# Altium schematic sheet Driveunit_RS485_Topsheet.SchDoc
size A3; SheetNumber: 1; SheetTotal: 1
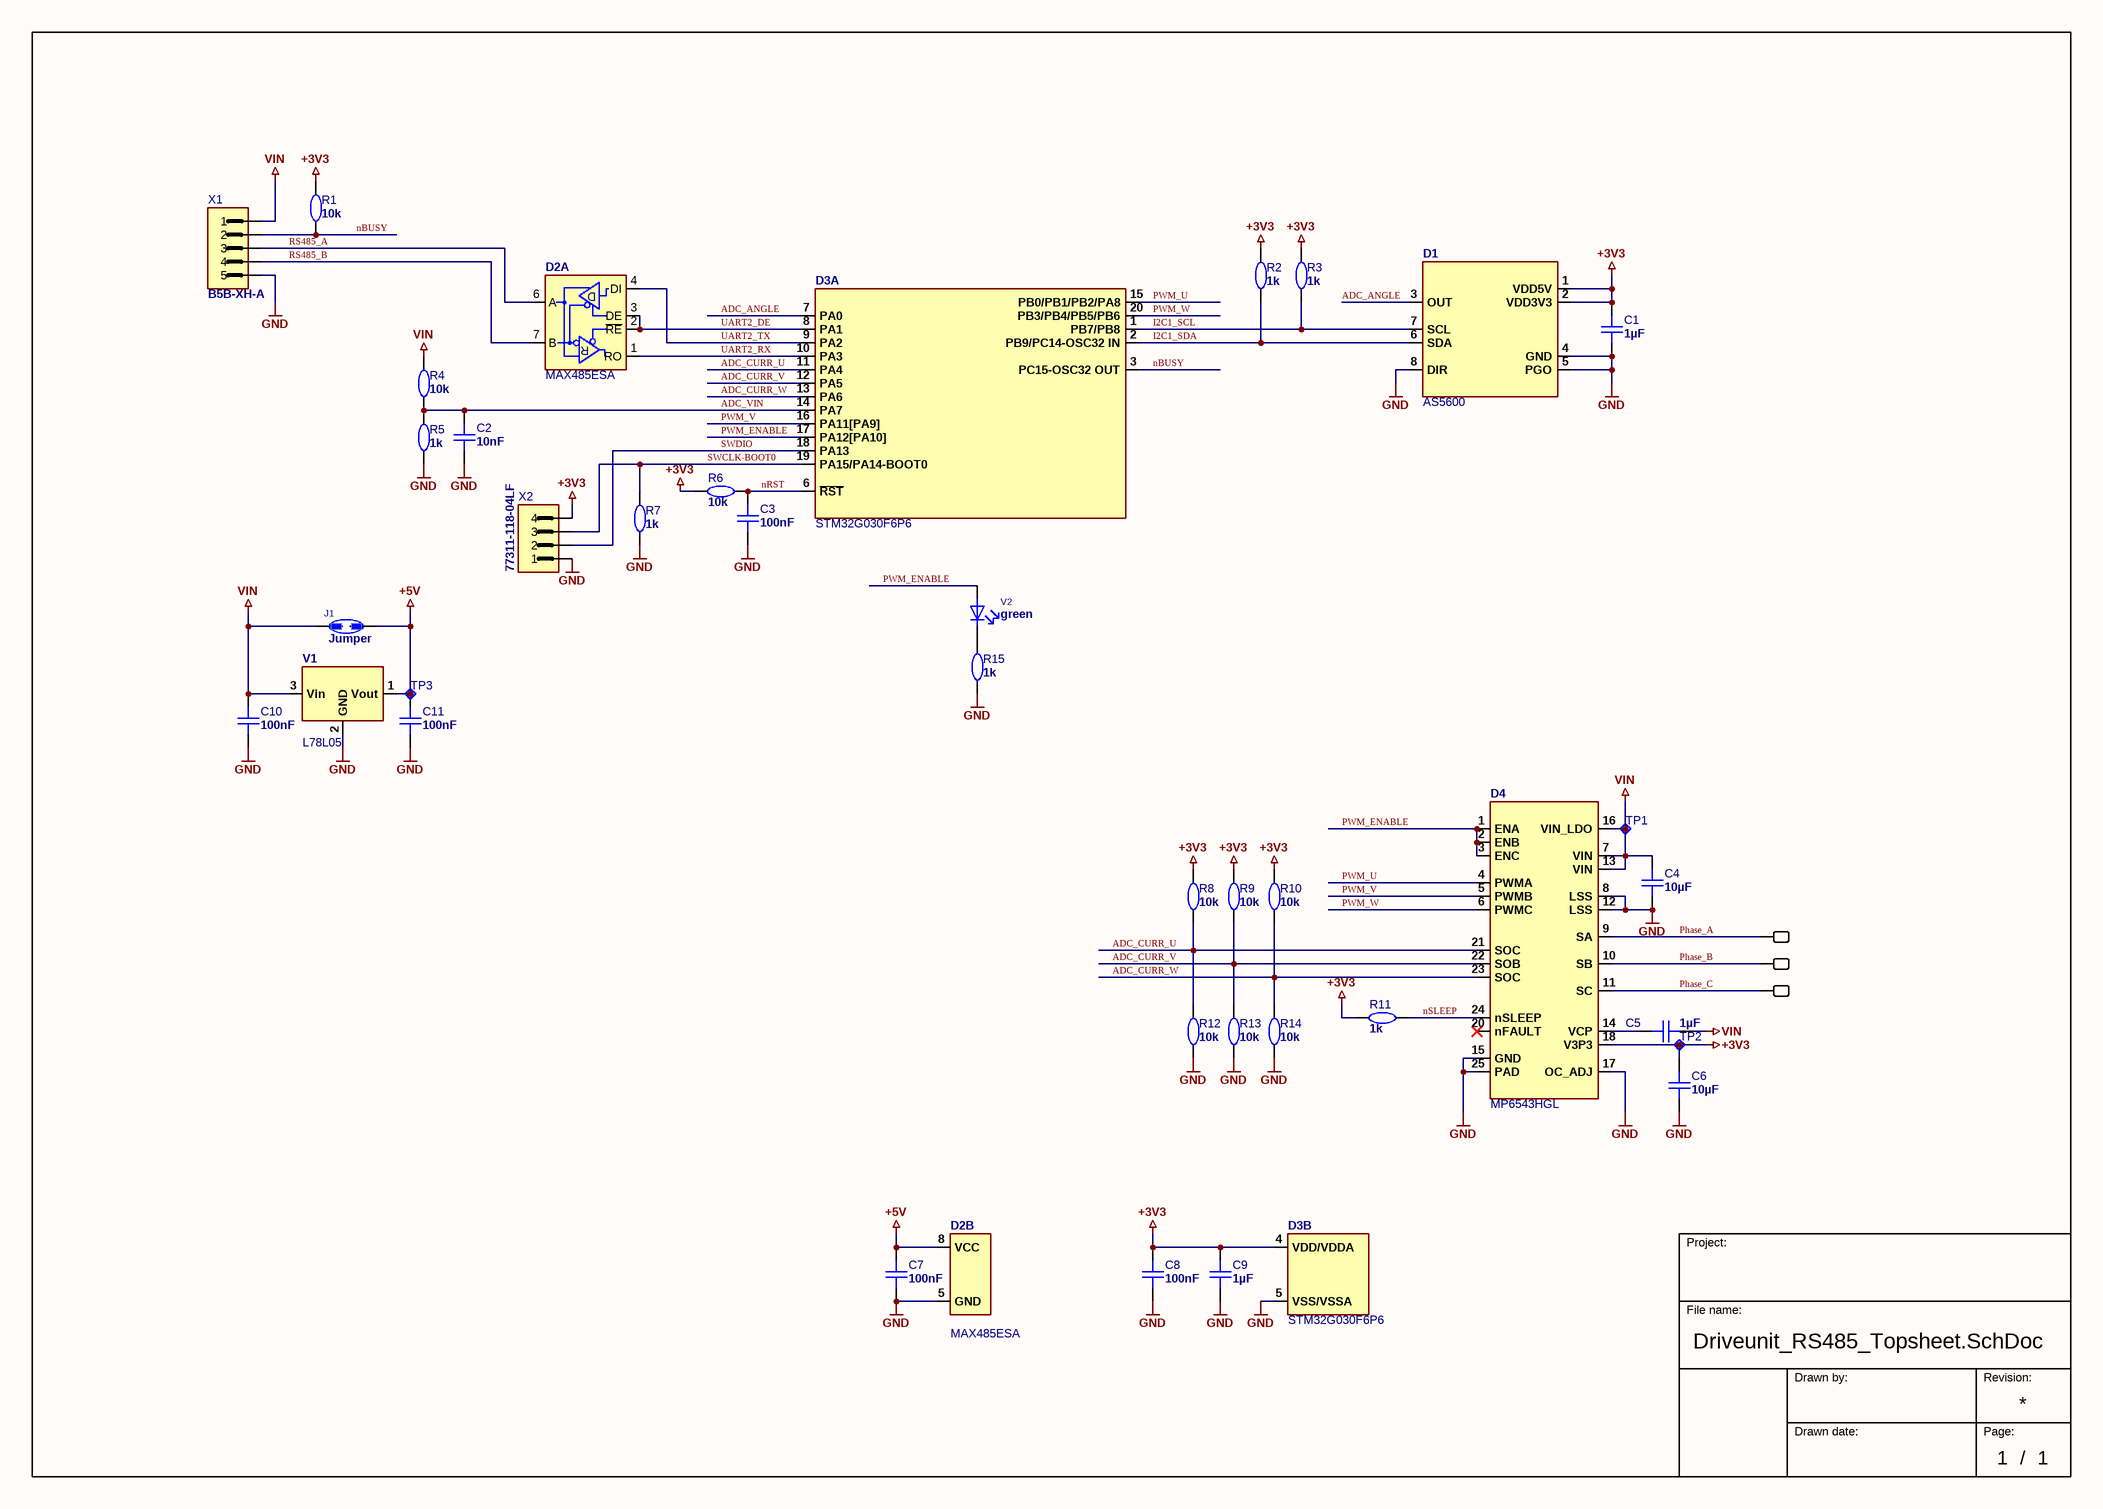
[diagram p0: Driveunit_RS485_Topsheet.SchDoc]

## Parts
C1  value 1µF  [C-0603_1608_095_L_RF]  (hidden comment: Cap 1u 0603)
C2  value 10nF  [C-0603_1608_095_L_RF]  (hidden comment: Cap 10n 0603)
C3  value 100nF  [C-0603_1608_095_L_RF]  (hidden comment: Cap 100n 0603)
C4  value 10µF  [C-1210_3225_230_L_RF]  (hidden comment: CAP 10u 1210)
C5  value 1µF  [C-0603_1608_095_L_RF]  (hidden comment: Cap 1u 0603)
C6  value 10µF  [C-0805_2012_145_L_RF]  (hidden comment: CAP 10u 16V 0805)
C7  value 100nF  [C-0603_1608_095_L_RF]  (hidden comment: Cap 100n 0603)
C8  value 100nF  [C-0603_1608_095_L_RF]  (hidden comment: Cap 100n 0603)
C9  value 1µF  [C-0603_1608_095_L_RF]  (hidden comment: Cap 1u 0603)
C10  value 100nF  [C-0603_1608_095_L_RF]  (hidden comment: Cap 100n 0603)
C11  value 100nF  [C-0603_1608_095_L_RF]  (hidden comment: Cap 100n 0603)
D1  AS5600  [SOIC8_N_RF]
D2  MAX485ESA  [SOIC8_N_RF]  (parts A,B of 2)
D3  STM32G030F6P6  [TSSOP20_N_RF]  (parts A,B of 2)
D4  MP6543HGL  [QFN24_5x7_N_RF]
J1  value Jumper  [J-1206_Solderjumper_2Pin]  (hidden comment: Solder jumper 2Pin)  (no BOM)
R1  value 10k  [R-0603_1608_050_L_RF]  (hidden comment: Res 10k 0603)
R2  value 1k  [R-0603_1608_050_L_RF]  (hidden comment: Res 1k 0603)
R3  value 1k  [R-0603_1608_050_L_RF]  (hidden comment: Res 1k 0603)
R4  value 10k  [R-0603_1608_050_L_RF]  (hidden comment: Res 10k 0603)
R5  value 1k  [R-0603_1608_050_L_RF]  (hidden comment: Res 1k 0603)
R6  value 10k  [R-0603_1608_050_L_RF]  (hidden comment: Res 10k 0603)
R7  value 1k  [R-0603_1608_050_L_RF]  (hidden comment: Res 1k 0603)
R8  value 10k  [R-0603_1608_050_L_RF]  (hidden comment: Res 10k 0603)
R9  value 10k  [R-0603_1608_050_L_RF]  (hidden comment: Res 10k 0603)
R10  value 10k  [R-0603_1608_050_L_RF]  (hidden comment: Res 10k 0603)
R11  value 1k  [R-0603_1608_050_L_RF]  (hidden comment: Res 1k 0603)
R12  value 10k  [R-0603_1608_050_L_RF]  (hidden comment: Res 10k 0603)
R13  value 10k  [R-0603_1608_050_L_RF]  (hidden comment: Res 10k 0603)
R14  value 10k  [R-0603_1608_050_L_RF]  (hidden comment: Res 10k 0603)
R15  value 1k  [R-0603_1608_050_L_RF]  (hidden comment: Res 1k 0603)
TP1  TestPoint 0.8mm  [TP_0.8mm]  (value not drawn)  (no BOM)
TP2  TestPoint 0.8mm  [TP_0.8mm]  (value not drawn)  (no BOM)
TP3  TestPoint 0.8mm  [TP_0.8mm]  (value not drawn)  (no BOM)
V1  L78L05  [SOT-89-3]
V2  value green  [LED-0603_1608_Green_L_RF]  (hidden comment: LED SMD 0603 Green)
X1  value B5B-XH-A  [X-0149X0057-R_M05_P0250_JST_B5B-XH-A]  (hidden comment: CONN HEADER XH 5POS THT)
X2  value 77311-118-04LF  [X-0101X0025_R_FCI_77311-118-04LF]  (hidden comment: CONN HEADER 4POS 1ROW THT 2.54MM)
X3  Solderpad_2x3  [Lötpad_2x3]  (value not drawn)  (no BOM)
X4  Solderpad_2x3  [Lötpad_2x3]  (value not drawn)  (no BOM)
X5  Solderpad_2x3  [Lötpad_2x3]  (value not drawn)  (no BOM)

## Nets
+3V3: C1.2 C6.2 C8.2 C9.2 D1.1(VDD5V) D1.2(VDD3V3) D3.4(VDD/VDDA) D4.18(V3P3) R1.2 R2.2 R3.2 R6.1 R8.2 R9.2 R10.2 R11.2 TP2.1 X2.4
+5V: C7.2 C11.2 D2.8(VCC) J1.2 TP3.1 V1.1(Vout)
GND: C1.1 C2.1 C3.1 C4.1 C6.1 C7.1 C8.1 C9.1 C10.1 C11.1 D1.4(GND) D1.5(PGO) D1.8(DIR) D2.5(GND) D3.5(VSS/VSSA) D4.8(LSS) D4.12(LSS) D4.15(GND) D4.17(OC_ADJ) D4.25(PAD) R5.1 R7.1 R12.1 R13.1 R14.1 R15.1 V1.2(GND) X1.5 X2.1
VIN: C4.2 C5.2 C10.2 D4.7(VIN) D4.13(VIN) D4.16(VIN_LDO) J1.1 R4.2 TP1.1 V1.3(Vin) X1.1
ADC_ANGLE: D1.3(OUT) D3.7(PA0)
ADC_CURR_U: D3.11(PA4) D4.21(SOC) R8.1 R12.2
ADC_CURR_V: D3.12(PA5) D4.22(SOB) R9.1 R13.2
ADC_CURR_W: D3.13(PA6) D4.23(SOC) R10.1 R14.2
ADC_VIN: C2.2 D3.14(PA7) R4.1 R5.2
I2C1_SCL: D1.7(SCL) D3.1(PB7/PB8) R3.1
I2C1_SDA: D1.6(SDA) D3.2(PB9/PC14-OSC32_IN) R2.1
nBUSY: D3.3(PC15-OSC32_OUT) R1.1 X1.2
nRST: C3.2 D3.6(~{RST}) R6.2
nSLEEP: D4.24(nSLEEP) R11.1
Phase_A: D4.9(SA) X3.1
Phase_B: D4.10(SB) X4.1
Phase_C: D4.11(SC) X5.1
PWM_ENABLE: D3.17(PA12[PA10]) D4.1(ENA) D4.2(ENB) D4.3(ENC) V2.1
PWM_U: D3.15(PB0/PB1/PB2/PA8) D4.4(PWMA)
PWM_V: D3.16(PA11[PA9]) D4.5(PWMB)
PWM_W: D3.20(PB3/PB4/PB5/PB6) D4.6(PWMC)
RS485_A: D2.6(A) X1.3
RS485_B: D2.7(B) X1.4
SWCLK-BOOT0: D3.19(PA15/PA14-BOOT0) R7.2 X2.3
SWDIO: D3.18(PA13) X2.2
UART2_DE: D2.2(~{RE}) D2.3(DE) D3.8(PA1)
UART2_RX: D2.1(RO) D3.10(PA3)
UART2_TX: D2.4(DI) D3.9(PA2)
NetC5_1: C5.1 D4.14(VCP)
NetR15_2: R15.2 V2.2

Not connected (* = marked no-connect by the designer): D4 20(nFAULT)*

## Notes on the sheet
- Project:
- File name:
- Drawn by:
- Revision:
- Drawn date:
- Page:
- /
- (in symbol MAX485ESA, part A) D; R

## Library data of the parts
C1 C5 C9 = CMP-001-0045-3: Cap Cer SMD 1u 16V 10% 0603 X7R; Manufacturer Part Number: 0603YC105KAT2A; Manufacturer: AVX; GPV_Number: 1749.0125; User: epph; Prefered: true; Manufacturer Part Number 2: C0603C105K4RACTU; ClassName: Surface_Assy; Technology: SMT; Manufacturer 2: KEMET; PartStatus: Release; Case / Package: 0603
C2 = CMP-001-0040-3: Cap Cer SMD 10n 50V 10% 0603 X7R; Manufacturer: AVX; Manufacturer Part Number: 06035C103KAT; GPV_Number: 1749.0004; Prefered: true; User: epph; MNL_Number: 22310403; ClassName: Surface_Assy; PartStatus: Release; Case / Package: 0603; Technology: SMT
C3 C7 C8 C10 C11 = CMP-001-0036-2: Cap Cer SMD 100n 100V 10% 0603 X7R; Manufacturer Part Number: GRM188R72A104KA35; Manufacturer: MURATA; GPV_Number: 1749.0196; User: zupa; Prefered: false; Case / Package: 0603; ComponentLink1Description: Datasheet; PartStatus: Release; ComponentLink1URL: https://datasheet.ciiva.com/34302/1857815-34302863.pdf; ClassName: Surface_Assy; Technology: SMT
C4 = CMP-001-0198-2: CAP CER 10uF 50V X7S 1210; Manufacturer: TDK; Manufacturer Part Number: C3225X7S1H106K250AE; User: zupa; GPV_Number: 1752.0100; Technology: SMT; ClassName: Surface_Assy; ComponentLink1Description: Datasheet; PartStatus: Release; ComponentLink1URL: https://datasheet.ciiva.com/24218/c3225x7s1h106k250ae-265440-24218657.pdf?src-supplier=Mouser; Case / Package: 1210
C6 = CMP-001-0177-2: Cap Cer SMD 10u 16V 10% 0805 X5R; Manufacturer Part Number: 0805YD106KAT2A; Manufacturer: AVX; Prefered: true; GPV_Number: 1750.0241; User: zupa; PartStatus: Release; ComponentLink1URL: https://datasheet.ciiva.com/152/cx5r-152114.pdf; Case / Package: 0805; ComponentLink1Description: Datasheet; Technology: SMT; ClassName: Surface_Assy
D1 = AS5600: IC Sensor Rotation Magnet 12bit; Part_validated: No; Manufacturer: AMS; GPV_Number: xxxx.xxxx; MNL_Number: xxxxxxxx; Value: AS5600; Footprint_validated: No; PartStatus: New; System: -; ClassName: Surface_Assy; Case/Package: SO-8; Technology: SMT; Manufacturer Part Number: AS5600
D2 = MAX485ESA: IC Transceiver RS485 5V; Part_validated: No; Manufacturer: Maxim; MNL_Number: xxxxxxxx; Value: MAX485ESA; Footprint_validated: No; PartStatus: New; System: -; ClassName: Surface_Assy; Case/Package: SO8; Technology: SMT; Manufacturer Part Number: MAX485ESA
D3 = STM32G030F6P6: IC MCU Cortex M0+ 32K Flash, 8K RAM, 64MHz; Part_validated: No; Manufacturer: ST; GPV_Number: xxxx.xxxx; MNL_Number: xxxxxxxx; Value: STM32G030F6P6; Footprint_validated: No; PartStatus: New; System: -; ClassName: Surface_Assy; Case/Package: TSSOP20; Technology: SMT; Manufacturer Part Number: STM32G030F6P6; Supplier 1: Arrow Electronics; Supplier Part Number 1: STM32G030F6P6TR
D4 = MP6543HGL-A-P: Motor Driver 3-Phase 3-22V 2A; Part_validated: No; Manufacturer: Monolithic Power Systems; GPV_Number: xxxx.xxxx; MNL_Number: xxxxxxxx; Value: MP6543HGL; Footprint_validated: No; PartStatus: New; System: -; ClassName: Surface_Assy; Case/Package: QFN-24; Technology: SMT; Manufacturer Part Number: MP6543HGL-A-P
J1 = CMP-00136-2: User: epph; PartStatus: Release; ClassName: Surface_Assy; Technology: SYM
R1 R4 R6 R8-R10 R12-R14 = CMP-001-0241-3: Res SMD 10k 1% 0.1W 0603; Manufacturer: YAGEO; Manufacturer Part Number: RC0603FR-0710KL; MNL_Number: 15310022; GPV_Number: 1922.0100; User: zupa; Prefered: true; Case / Package: 0603; ClassName: Surface_Assy; PartStatus: Release; ComponentLink1URL: https://datasheet.ciiva.com/11808/0900766b80f96399-11808280.pdf; ComponentLink1Description: Datasheet; Technology: SMT
R2 R3 R5 R7 R11 R15 = CMP-001-0250-3: Res SMD 1k 1% 0.1W 0603; Manufacturer: YAGEO; Manufacturer Part Number: RC0603FR-071KL; MNL_Number: 15310012; User: zupa; GPV_Number: 1922.0011; Prefered: true; Technology: SMT; ComponentLink1Description: Datasheet; ClassName: Surface_Assy; ComponentLink1URL: https://datasheet.ciiva.com/11808/0900766b80f96399-11808280.pdf; Case / Package: 0603; PartStatus: Release
TP1-TP3 = CMP-001-1515-1: Value: TP; User: zupa; ClassName: Testpoint; GPV_Number: -; PartStatus: Release; Technology: SMT
V1 = L78L05: IC REG 5V SOT-89-3 7-30V 100mA; Part_validated: No; Manufacturer: ST; GPV_Number: xxxx.xxxx; MNL_Number: xxxxxxxx; Value: L78L05; Footprint_validated: No; PartStatus: New; System: -; ClassName: Surface_Assy; Case/Package: SOT-89-3; Technology: SMT; Manufacturer Part Number: L78L05
V2 = CMP-001-1208-7: LED Green LTST-C190KGKT 0603; Manufacturer: Lite-On Inc; User: epph; GPV_Number: 1602.0827; Case / Package: 0603; PartStatus: Release; Technology: SMT; ClassName: Surface_Assy; Manufacturer Part Number: LTST-C190KGKT
X1 = CMP-00143-4: CONN HEADER  5POS_JST_B5B-XH; Manufacturer: JST; User: balu; GPV_Number: 4401.4954; System: Connector; Manufacturer Part Number: B5B-XH-A; ClassName: Through-Hole_Assy; Technology: THT; PartStatus: Release
X2 = CMP-001-1284-4: CONN HEADER 4POS 1ROW THT 2.54MM FCI 77311-118-04LF; System: Connector; GPV_Number: 4401.2630; User: zupa; Manufacturer: FCI; Technology: THT; PartStatus: Release; ClassName: Through-Hole_Assy; Manufacturer Part Number: 77311-118-04LF; ComponentLink1URL: http://portal.fciconnect.com/Comergent//fci/drawing/77311.pdf; ComponentLink1Description: Datasheet
X3-X5 = Lötpad_2mmx3mm: Solderpad 2mm x 3mm; Part_validated: No; GPV_Number: xxxx.xxxx; System: Connector; MNL_Number: xxxxxxxx; Value: Solderpad_2x3; Footprint_validated: No; PartStatus: New; ClassName: Testpoint; Case/Package: -; Technology: SMT; Manufacturer: -; Manufacturer Part Number: -